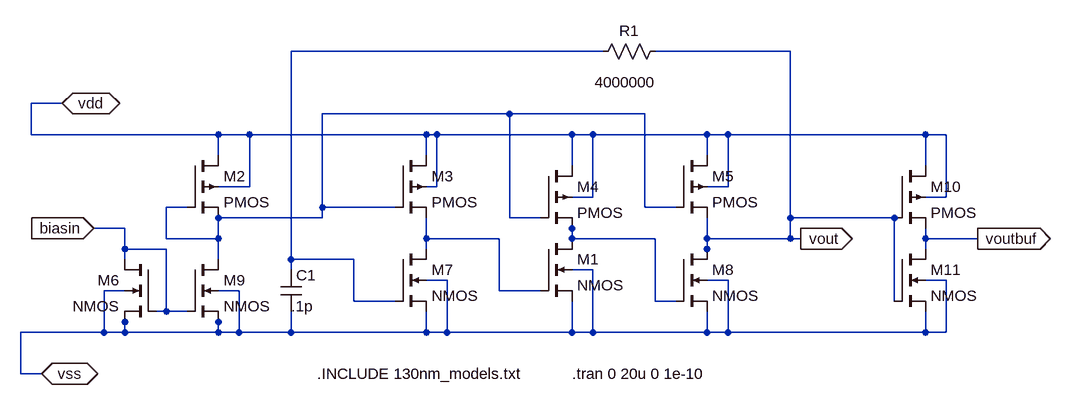
[diagram p0: schematic lphysteresistoscillatorsym5.asc]
lphysteresistoscillatorsym5.asc, the LTspice schematic file:
Version 4
SHEET 1 932 680
WIRE 208 -64 -272 -64
WIRE 496 -64 288 -64
WIRE -624 16 -672 16
WIRE 64 32 -224 32
WIRE 272 32 64 32
WIRE -672 64 -672 16
WIRE -384 64 -672 64
WIRE -336 64 -384 64
WIRE -64 64 -336 64
WIRE -48 64 -64 64
WIRE 160 64 -48 64
WIRE 192 64 160 64
WIRE 368 64 192 64
WIRE 400 64 368 64
WIRE 704 64 400 64
WIRE 736 64 704 64
WIRE -384 96 -384 64
WIRE -64 96 -64 64
WIRE 368 96 368 64
WIRE 160 112 160 64
WIRE 704 112 704 64
WIRE -336 144 -336 64
WIRE -336 144 -384 144
WIRE -48 144 -48 64
WIRE -48 144 -64 144
WIRE 400 144 400 64
WIRE 400 144 368 144
WIRE 192 160 192 64
WIRE 192 160 160 160
WIRE 736 160 736 64
WIRE 736 160 704 160
WIRE -432 176 -464 176
WIRE -224 176 -224 32
WIRE -112 176 -224 176
WIRE 272 176 272 32
WIRE 320 176 272 176
WIRE -224 192 -224 176
WIRE -224 192 -384 192
WIRE 64 192 64 32
WIRE 112 192 64 192
WIRE 496 192 496 -64
WIRE 656 192 496 192
WIRE -528 208 -576 208
WIRE 160 208 160 192
WIRE -464 224 -464 176
WIRE -384 224 -384 192
WIRE -384 224 -464 224
WIRE -64 224 -64 192
WIRE 48 224 -64 224
WIRE 160 224 160 208
WIRE 288 224 160 224
WIRE 368 224 368 192
WIRE 496 224 496 192
WIRE 496 224 368 224
WIRE 512 224 496 224
WIRE 704 224 704 208
WIRE 784 224 704 224
WIRE -528 240 -528 208
WIRE -464 240 -528 240
WIRE -64 240 -64 224
WIRE 368 240 368 224
WIRE 704 240 704 224
WIRE -528 256 -528 240
WIRE -384 256 -384 224
WIRE -272 256 -272 -64
WIRE -176 256 -272 256
WIRE 368 256 368 240
WIRE -272 272 -272 256
WIRE 192 272 160 272
WIRE -32 288 -64 288
WIRE 400 288 368 288
WIRE 736 288 704 288
WIRE -528 304 -560 304
WIRE -352 304 -384 304
WIRE 48 304 48 224
WIRE 112 304 48 304
WIRE -176 320 -176 256
WIRE -112 320 -176 320
WIRE 288 320 288 224
WIRE 320 320 288 320
WIRE 656 320 656 192
WIRE -464 336 -464 240
WIRE -464 336 -480 336
WIRE -432 336 -464 336
WIRE -528 352 -528 336
WIRE -384 352 -384 336
WIRE -560 368 -560 304
WIRE -560 368 -688 368
WIRE -528 368 -528 352
WIRE -528 368 -560 368
WIRE -384 368 -384 352
WIRE -384 368 -528 368
WIRE -352 368 -352 304
WIRE -352 368 -384 368
WIRE -272 368 -272 336
WIRE -272 368 -352 368
WIRE -64 368 -64 336
WIRE -64 368 -272 368
WIRE -32 368 -32 288
WIRE -32 368 -64 368
WIRE 160 368 160 320
WIRE 160 368 -32 368
WIRE 192 368 192 272
WIRE 192 368 160 368
WIRE 368 368 368 336
WIRE 368 368 192 368
WIRE 400 368 400 288
WIRE 400 368 368 368
WIRE 704 368 704 336
WIRE 704 368 400 368
WIRE 736 368 736 288
WIRE 736 368 704 368
WIRE -688 432 -688 368
WIRE -656 432 -688 432
FLAG 512 224 vout
IOPIN 512 224 Out
FLAG -656 432 vss
IOPIN -656 432 BiDir
FLAG -624 16 vdd
IOPIN -624 16 BiDir
FLAG -576 208 biasin
IOPIN -576 208 In
FLAG 784 224 voutbuf
IOPIN 784 224 Out
SYMBOL nmos4 112 224 R0
SYMATTR InstName M1
SYMATTR Value2 l=1u w=10u
SYMBOL pmos4 -432 96 R0
SYMATTR InstName M2
SYMATTR Value2 l=1u w=10u
SYMBOL pmos4 -112 96 R0
SYMATTR InstName M3
SYMATTR Value2 l=1u w=10u
SYMBOL pmos4 112 112 R0
SYMATTR InstName M4
SYMATTR Value2 l=1u w=10u
SYMBOL pmos4 320 96 R0
SYMATTR InstName M5
SYMATTR Value2 l=1u w=200u
SYMBOL nmos4 -112 240 R0
SYMATTR InstName M7
SYMATTR Value2 l=.2u w=5u
SYMBOL nmos4 320 240 R0
SYMATTR InstName M8
SYMATTR Value2 l=.2u w=4u
SYMBOL cap -288 272 R0
WINDOW 3 16 56 Left 2
SYMATTR Value .1p
SYMATTR InstName C1
SYMBOL res 304 -80 R90
WINDOW 0 0 56 VBottom 2
WINDOW 3 48 62 VTop 2
SYMATTR InstName R1
SYMATTR Value 4000000
SYMBOL nmos4 -480 256 M0
SYMATTR InstName M6
SYMATTR Value2 l=.2u w=5u
SYMBOL nmos4 -432 256 R0
SYMATTR InstName M9
SYMATTR Value2 l=.2u w=2u
SYMBOL pmos4 656 112 R0
SYMATTR InstName M10
SYMATTR Value2 l=.2u w=2u
SYMBOL nmos4 656 240 R0
SYMATTR InstName M11
SYMATTR Value2 l=.2u w=1u
TEXT -232 432 Left 2 !.INCLUDE 130nm_models.txt
TEXT 160 432 Left 2 !.tran 0 20u 0 1e-10

The netlist it stands for:
* lphysteresistoscillatorsym5.asc
M1 N003 N004 vss vss NMOS l=1u w=10u
M2 vdd N002 N002 vdd PMOS l=1u w=10u
M3 vdd N002 N004 vdd PMOS l=1u w=10u
M4 vdd N002 N003 vdd PMOS l=1u w=10u
M5 vdd N002 vout vdd PMOS l=1u w=200u
M7 N004 N001 vss vss NMOS l=.2u w=5u
M8 vout N003 vss vss NMOS l=.2u w=4u
C1 N001 vss .1p
R1 vout N001 4000000
M6 biasin biasin vss vss NMOS l=.2u w=5u
M9 N002 biasin vss vss NMOS l=.2u w=2u
M10 vdd vout voutbuf vdd PMOS l=.2u w=2u
M11 voutbuf vout vss vss NMOS l=.2u w=1u
.model NMOS NMOS
.model PMOS PMOS
.lib standard.mos
.INCLUDE 130nm_models.txt
.tran 0 20u 0 1e-10
.backanno
.end